# EAGLE design MB-Arduino-uno (EAGLE 9.5.2)
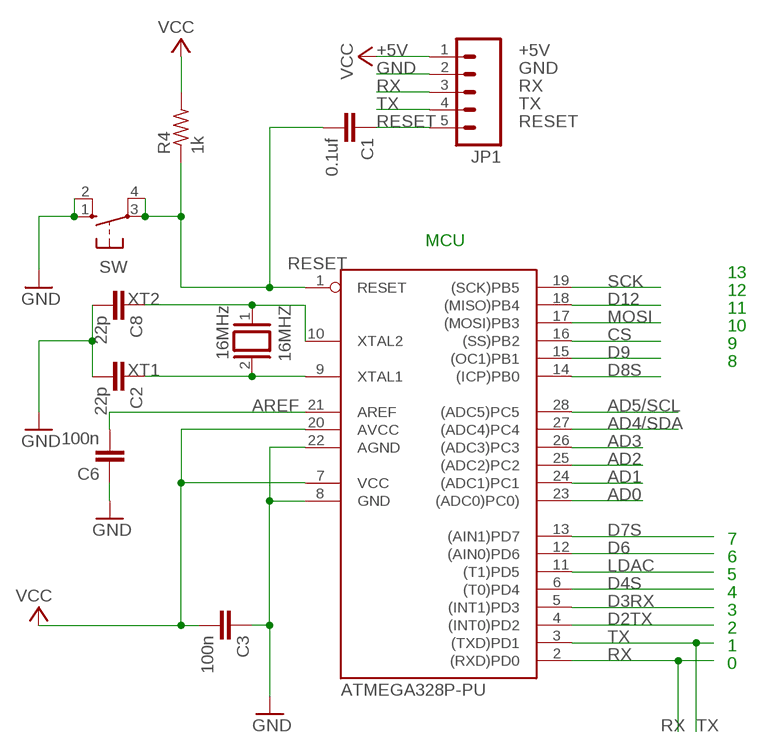
[diagram p0: schematic, sheet 1]

## Parts
16MHZ  16MHz  XTAL/S  [QS]
C1  0.1uf  C2.5/2  [C2.5-2]
C2  22p  C2.5/2  [C2.5-2]
C3  100n  C2.5/2  [C2.5-2]
C6  100n  C2.5/2  [C2.5-2]
C8  22p  C2.5/2  [C2.5-2]
IC  ATMEGA328P-PU  [DIL28-3]
JP1  M05PTH  [1X05]
R4  1k  R-US_0204/7  [0204/7]
SW  10-XX  [B3F-10XX]

## Nets
+5V [usbvcc]: C3.2 IC.7(VCC) IC.20(AVCC) JP1.1 R4.2 ; supply symbol labelled VCC
AD0: IC.23((ADC0)PC0))
AD1: IC.24((ADC1)PC1)
AD2: IC.25((ADC2)PC2)
AD3: IC.26((ADC3)PC3)
AD4/SDA: IC.27((ADC4)PC4)
AD5/SCL: IC.28((ADC5)PC5)
AREF [aref]: C6.2 IC.21(AREF)
CS: IC.16((SS)PB2)
D2TX: IC.4((INT0)PD2)
D3RX: IC.5((INT1)PD3)
D4S: IC.6((T0)PD4)
D6: IC.12((AIN0)PD6)
D7S: IC.13((AIN1)PD7)
D8S: IC.14((ICP)PB0)
D9: IC.15((OC1)PB1)
D12: IC.18((MISO)PB4)
GND: C2.2 C3.1 C6.1 C8.2 IC.8(GND) IC.22(AGND) JP1.2 SW.1(S) SW.2(S1)
LDAC: IC.11((T1)PD5)
MOSI: IC.17((MOSI)PB3)
RESET: C1.1 C1.2 IC.1(RESET) JP1.5 R4.1 SW.3(P) SW.4(P1)
RX: IC.2((RXD)PD0) JP1.3
SCK: IC.19((SCK)PB5)
TX: IC.3((TXD)PD1) JP1.4
XT1: 16MHZ.2 C2.1 IC.9(XTAL1)
XT2: 16MHZ.1 C8.1 IC.10(XTAL2)

## Notes on the sheet
- MCU
- 13
- 12
- 11
- 10
- 9
- 8
- 7
- 6
- 5
- 4
- 3
- 2
- 1
- 0

## Library data of the parts
16MHZ = SmartPrj:XTAL/S: CRYSTAL
C1-C3 C6 C8 = capacitor-wima:C: CAPACITOR naming: grid - package width
IC = SmartPrj:ATMEGA328P-: MICROCONTROLLER 4 Kbytes FLASH 128 bytes SRAM 256 bytes EEPROM UART 6-channel 10 bit ADC
JP1 = SparkFun-Connectors:M05: Header 5 Standard 5-pin 0.1" header. Use with straight break away headers (SKU : PRT-00116), right angle break away headers (PRT-00553), swiss pins (PRT-00743), machine pins (PRT-00117), and female headers (PRT-00115). Molex polarized connector foot print use with SKU : PRT-08230 with associated crimp pins and housings.
R4 = adafruit:R-US_: RESISTOR, American symbol
SW = DC_LOAD_AU:10-XX: OMRON SWITCH; MPN: B3F-1000; OC_FARNELL: 176432; OC_NEWARK: 36M3542

## Net classes
1 power: width 0.61 mm, drill 0.61 mm, clearance 0.254 mm
2 gnd: width 0.305 mm, drill 0.559 mm, clearance 0.254 mm
3 usbvcc: width 0.508 mm, drill 0.61 mm, clearance 0.254 mm
4 aref: width 0.406 mm, drill 0.61 mm, clearance 0.254 mm

## Board
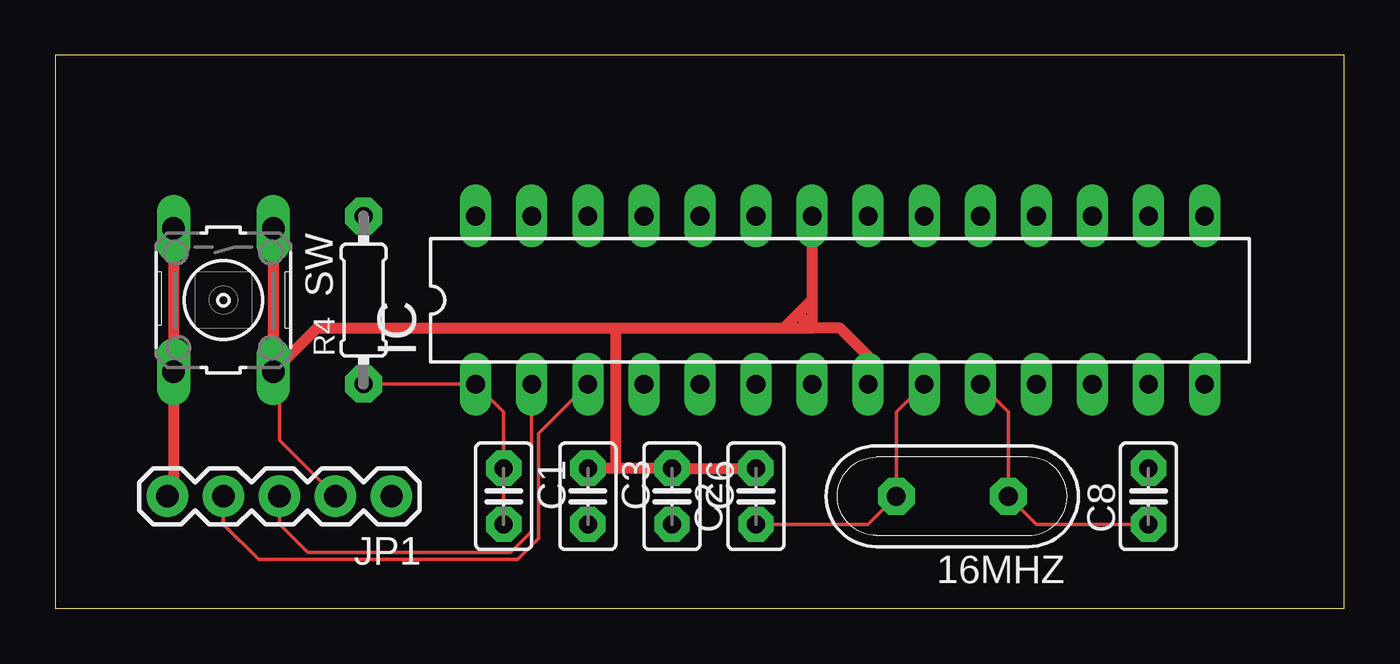
[diagram p1: board, top side]
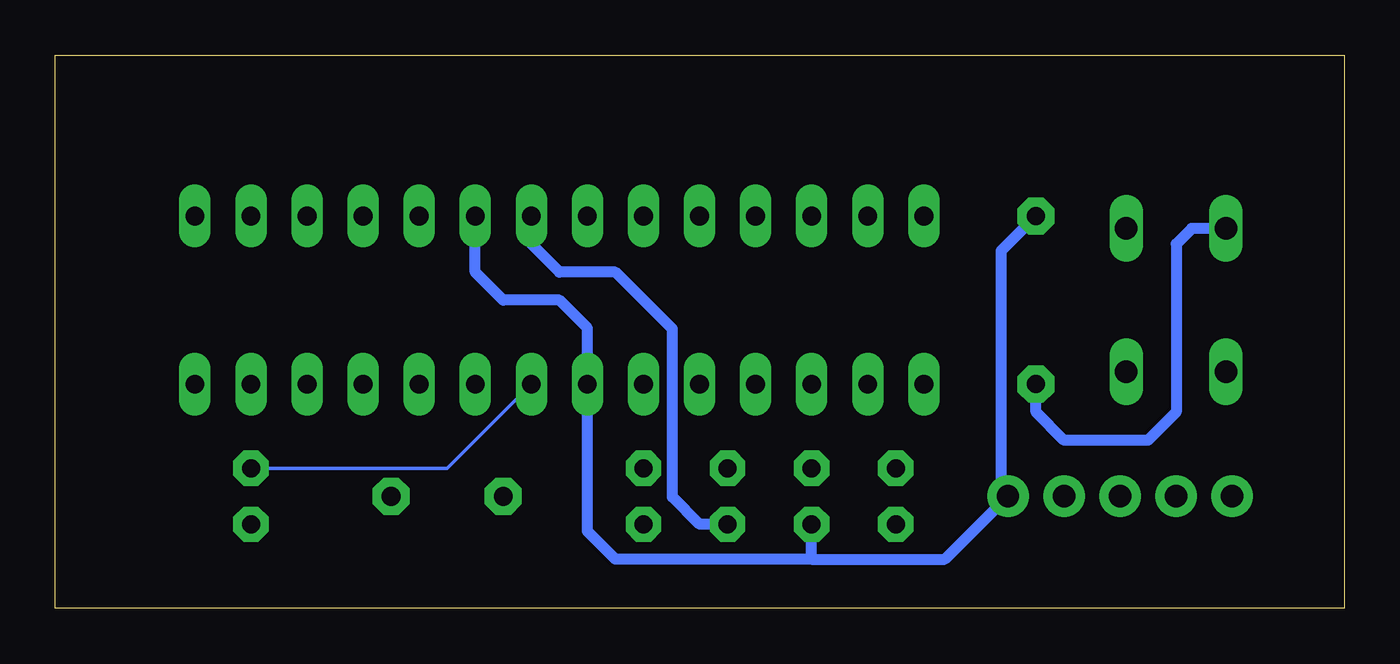
[diagram p2: board, bottom side, seen from below]

Size 58.4 x 25.07 mm. Coordinates in mm from the lower left corner, seen from the top.
Outline: 0,0 58.4,0 58.4,25.07 0,25.07 0,0
Copper layers (1*16): Top 0.035mm / dielectric 1.5mm / Bottom 0.035mm
Design rules "default": minimum track width 6mil, minimum drill 0.35mm, track to track 6mil, track to pad 6mil, pad to pad 6mil, via to via 6mil, smd to smd 6mil, copper to edge 40mil, drill to drill 6mil, minimum pad ring 10mil, minimum via ring 8mil, stop-mask expansion 4mil, vias tented up to drill 0mil, thermal gap 10mil

### Footprints (pad centres in the part's own frame; a part is rotated, then mirrored left to right if it is on the bottom)
QS = drill 0.85 pad 1.676 octagon: 1 -2.54,0; 2 2.54,0
C2.5-2 = drill 0.813 pad 1.6 octagon: 1 -1.27,0; 2 1.27,0
DIL28-3 = drill 0.85 pad 1.422 long: 1 -16.51,-3.81; 2 -13.97,-3.81; 3 -11.43,-3.81; 4 -8.89,-3.81; 5 -6.35,-3.81; 6 -3.81,-3.81; 7 -1.27,-3.81; 8 1.27,-3.81; 9 3.81,-3.81; 10 6.35,-3.81; 11 8.89,-3.81; 12 11.43,-3.81; 13 13.97,-3.81; 14 16.51,-3.81; 15 16.51,3.81; 16 13.97,3.81; 17 11.43,3.81; 18 8.89,3.81; 19 6.35,3.81; 20 3.81,3.81; 21 1.27,3.81; 22 -1.27,3.81; 23 -3.81,3.81; 24 -6.35,3.81; 25 -8.89,3.81; 26 -11.43,3.81; 27 -13.97,3.81; 28 -16.51,3.81
1X05 = drill 1.016 pad 1.88: 1 0,0; 2 2.54,0; 3 5.08,0; 4 7.62,0; 5 10.16,0
0204/7 = drill 0.813 pad 1.676 octagon: 1 -3.81,0; 2 3.81,0
B3F-10XX = drill 1.016 long: 1 -3.251,2.261; 2 3.251,2.261; 3 -3.251,-2.261; 4 3.251,-2.261

### Placement (x,y rotation side)
16MHZ  40.64,5.08 180 top
C1  20.32,5.08 270 top
C2  31.75,5.08 90 top
C3  24.13,5.08 270 top
C6  27.94,5.08 270 top
C8  49.53,5.08 90 top
IC  35.56,13.97 0 top
JP1  15.24,5.08 180 top
R4  13.97,13.97 90 top
SW  7.62,13.97 270 top

### Tracks (layer width: path | path; a pad name or v marks a point on that pad's centre or on a via)
+5V
  Bottom 0.508: R4.2 15.56,16.19 15.56,5.08 JP1.1 18.1,2.22 24.13,2.22 | 24.13,2.22 C3.2 | 24.13,2.22 33.02,2.22 34.29,3.49 IC.7 34.29,12.7 35.56,13.97 38.1,13.97 39.37,15.24 IC.20
AREF
  Bottom 0.508: IC.21 36.83,16.51 35.56,15.24 33.02,15.24 30.44,12.66 30.44,5.04 29.21,3.81 C6.2
GND
  Top 0.152: 9.84,12.06 9.84,17.14 SW.1 | 9.84,12.06 9.84,10.79 SW.2 | JP1.2 10.16,7.62 10.16,10.48 SW.2 | 9.84,12.06 SW.2
  Top 0.508: IC.22 34.29,13.97 | C2.2 C6.1 25.4,6.35 | 25.4,6.35 C3.1 | 25.4,6.35 25.4,12.7 | 25.4,12.7 33.02,12.7 | 33.02,12.7 34.29,12.7 | SW.2 11.86,12.7 25.4,12.7 | SW.1 9.88,10.76 10.16,10.48 | 33.02,12.7 33.66,13.34 | 33.66,13.34 34.29,13.97 | 34.29,13.97 34.29,12.7 | 34.29,12.7 33.66,13.34 | 34.29,12.7 35.56,12.7 36.83,11.43 IC.8
  Bottom 0.152: C8.2 40.64,6.35 IC.8
RESET
  Top 0.152: C1.2 C1.1 20.32,8.89 IC.1 R4.1 | 5.08,10.48 SW.4 5.4,10.79 5.4,17.14 SW.3
  Top 0.508: SW.3 5.36,5.36 JP1.5
  Bottom 0.508: SW.3 6.91,17.22 7.62,16.51 7.62,8.89 8.89,7.62 12.7,7.62 13.97,8.89 R4.1
RX
  Top 0.152: IC.2 21.59,3.49 20.64,2.54 11.43,2.54 10.16,3.81 JP1.3
TX
  Top 0.152: IC.3 21.91,7.94 21.91,3.17 20.95,2.22 9.21,2.22 7.62,3.81 JP1.4
XT1
  Top 0.152: IC.9 38.1,8.89 16MHZ.2 36.83,3.81 C2.1
XT2
  Top 0.152: IC.10 43.18,8.89 16MHZ.1 44.45,3.81 C8.1